# Altium schematic sheet Processor_1.SchDoc
size A3; CmpIndex: 3; SymIndex: 29
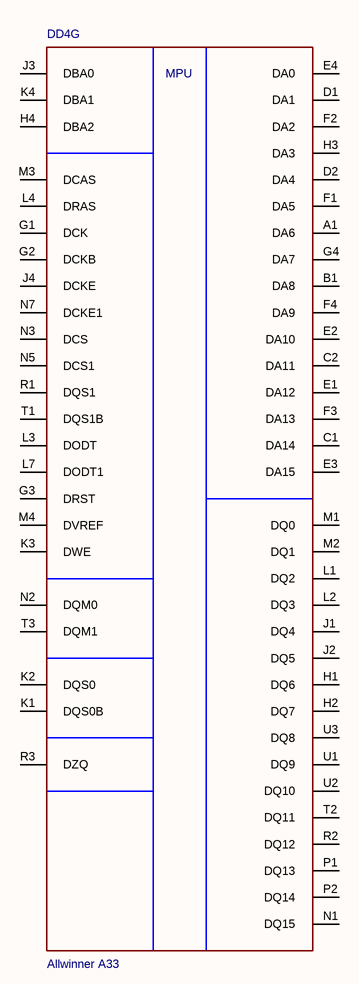
[diagram p0: Processor_1.SchDoc]

## Parts
DD4  Allwinner A33  (part G of 7)

## Nets

Not connected (* = marked no-connect by the designer): DD4 A1(DA6) B1(DA8) C1(DA14) C2(DA11) D1(DA1) D2(DA4) E1(DA12) E2(DA10) E3(DA15) E4(DA0) F1(DA5) F2(DA2) F3(DA13) F4(DA9) G1(DCK) G2(DCKB) G3(DRST) G4(DA7) H1(DQ6) H2(DQ7) H3(DA3) H4(DBA2) J1(DQ4) J2(DQ5) J3(DBA0) J4(DCKE) K1(DQS0B) K2(DQS0) K3(DWE) K4(DBA1) L1(DQ2) L2(DQ3) L3(DODT) L4(DRAS) L7(DODT1) M1(DQ0) M2(DQ1) M3(DCAS) M4(DVREF) N1(DQ15) N2(DQM0) N3(DCS) N5(DCS1) N7(DCKE1) P1(DQ13) P2(DQ14) R1(DQS1) R2(DQ12) R3(DZQ) T1(DQS1B) T2(DQ11) T3(DQM1) U1(DQ9) U2(DQ10) U3(DQ8)

## Notes on the sheet
- Лист
- Изм.
- № Докум.
- Подп.
- Дата
- (in symbol Allwinner A33, part G) MPU

## Library data of the parts
DD4 = Allwinner A33: CmpIndex: 80; DXDB_LIBNAME: Embedded Microprocessors; Ref Designator: DD4; SymIndex: 33; Orientation: 0 = 0; Part Label: Allwinner A33; Part Name: Allwinner A33; Part Number NP: Allwinner A33; Part Number: Allwinner A33